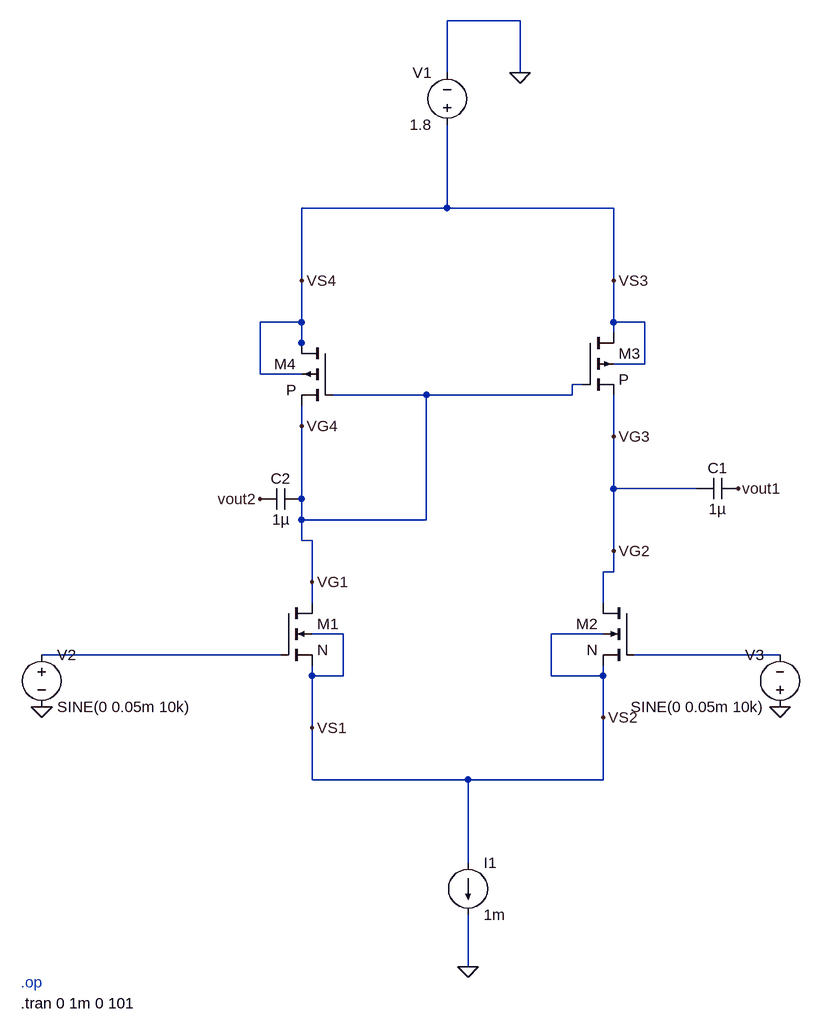
[diagram p0: schematic Draft2.asc]
Draft2.asc, the LTspice schematic file:
Version 4
SHEET 1 1476 1064
WIRE 1040 -464 928 -464
WIRE 928 -384 928 -464
WIRE 1040 -384 1040 -464
WIRE 928 -176 928 -304
WIRE 928 -176 704 -176
WIRE 1184 -176 928 -176
WIRE 704 -64 704 -176
WIRE 1184 -64 1184 -176
WIRE 704 0 704 -64
WIRE 704 0 640 0
WIRE 1184 0 1184 -64
WIRE 1232 0 1184 0
WIRE 1184 16 1184 0
WIRE 704 32 704 0
WIRE 704 48 704 32
WIRE 1232 64 1232 0
WIRE 1232 64 1184 64
WIRE 640 80 640 0
WIRE 704 80 640 80
WIRE 1136 96 1120 96
WIRE 896 112 752 112
WIRE 1120 112 1120 96
WIRE 1120 112 896 112
WIRE 704 160 704 128
WIRE 1184 176 1184 112
WIRE 1184 256 1184 176
WIRE 1312 256 1184 256
WIRE 704 272 704 160
WIRE 704 304 704 272
WIRE 896 304 896 112
WIRE 896 304 704 304
WIRE 704 336 704 304
WIRE 720 336 704 336
WIRE 1184 352 1184 256
WIRE 1184 384 1184 352
WIRE 1184 384 1168 384
WIRE 720 400 720 336
WIRE 720 432 720 400
WIRE 1168 432 1168 384
WIRE 768 480 720 480
WIRE 1168 480 1088 480
WIRE 672 512 304 512
WIRE 1440 512 1216 512
WIRE 720 544 720 528
WIRE 768 544 768 480
WIRE 768 544 720 544
WIRE 1088 544 1088 480
WIRE 1168 544 1168 528
WIRE 1168 544 1088 544
WIRE 1168 608 1168 544
WIRE 720 624 720 544
WIRE 720 704 720 624
WIRE 960 704 720 704
WIRE 1168 704 1168 608
WIRE 1168 704 960 704
WIRE 960 832 960 704
WIRE 960 992 960 912
FLAG 960 992 0
FLAG 1040 -384 0
FLAG 304 592 0
FLAG 1440 592 0
FLAG 1376 256 vout1
FLAG 640 272 vout2
FLAG 720 400 VG1
FLAG 1184 352 VG2
FLAG 720 624 VS1
FLAG 1168 608 VS2
FLAG 1184 -64 VS3
FLAG 704 -64 VS4
FLAG 1184 176 VG3
FLAG 704 160 VG4
SYMBOL nmos4 672 432 R0
SYMATTR InstName M1
SYMATTR Value N
SYMATTR Value2 l=1u w=300u
SYMBOL nmos4 1216 432 M0
SYMATTR InstName M2
SYMATTR Value N
SYMATTR Value2 l=1u w=300u
SYMBOL pmos4 1136 16 R0
SYMATTR InstName M3
SYMATTR Value P
SYMATTR Value2 l=1u w=15u
SYMBOL pmos4 752 32 M0
SYMATTR InstName M4
SYMATTR Value P
SYMATTR Value2 l=1u w=15u
SYMBOL current 960 832 R0
WINDOW 123 0 0 Left 0
WINDOW 39 0 0 Left 0
SYMATTR InstName I1
SYMATTR Value 1m
SYMBOL voltage 928 -288 R180
WINDOW 0 24 96 Left 2
WINDOW 3 24 16 Left 2
WINDOW 123 0 0 Left 0
WINDOW 39 0 0 Left 0
SYMATTR InstName V1
SYMATTR Value 1.8
SYMBOL cap 1376 240 R90
WINDOW 0 0 32 VBottom 2
WINDOW 3 32 32 VTop 2
SYMATTR InstName C1
SYMATTR Value 1µ
SYMBOL voltage 304 496 R0
WINDOW 123 0 0 Left 0
WINDOW 39 0 0 Left 0
SYMATTR InstName V2
SYMATTR Value SINE(0 0.05m 10k)
SYMBOL voltage 1440 608 R180
WINDOW 0 24 96 Left 2
WINDOW 3 24 16 Left 2
WINDOW 123 0 0 Left 0
WINDOW 39 0 0 Left 0
SYMATTR InstName V3
SYMATTR Value SINE(0 0.05m 10k)
SYMBOL cap 704 256 R90
WINDOW 0 0 32 VBottom 2
WINDOW 3 32 32 VTop 2
SYMATTR InstName C2
SYMATTR Value 1µ
TEXT 272 1016 Left 2 ;.op
TEXT 272 1048 Left 2 !.tran 0 1m 0 101

The netlist it stands for:
* Draft2.asc
M1 VG4 N001 VS2 VS2 N l=1u w=300u
M2 VG3 N002 VS2 VS2 N l=1u w=300u
M3 VS4 VG4 VG3 VS4 P l=1u w=15u
M4 VS4 VG4 VG4 VS4 P l=1u w=15u
I1 VS2 0 1m
V1 VS4 0 1.8
C1 vout1 VG3 1µ
V2 N001 0 SINE(0 0.05m 10k)
V3 0 N002 SINE(0 0.05m 10k)
C2 VG4 vout2 1µ
.model NMOS NMOS
.model PMOS PMOS
.lib standard.mos
* .op
.tran 0 1m 0 101
.backanno
.end